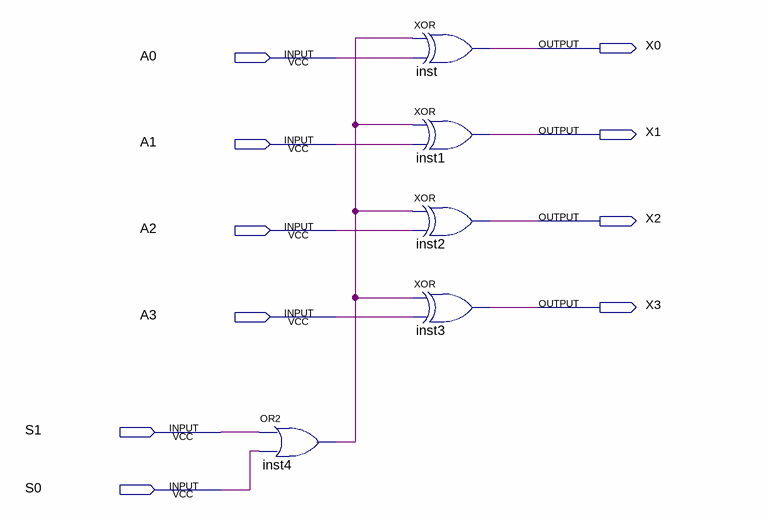
[diagram p0: schematic sheet]
// Quartus schematic BLOQUEX.bdf as structural Verilog: 5 symbols, 10 pins
module BLOQUEX (
  input  A0,
  input  A1,
  input  A2,
  input  A3,
  input  S1,
  input  S0,
  output X0,
  output X1,
  output X2,
  output X3
);

  wire inst4_out;

  or inst4 (inst4_out, S1, S0);
  xor inst (X0, inst4_out, A0);
  xor inst1 (X1, inst4_out, A1);
  xor inst2 (X2, inst4_out, A2);
  xor inst3 (X3, inst4_out, A3);
endmodule
